# Altium schematic sheet CropPred.SchDoc
size 152 x 101 mm
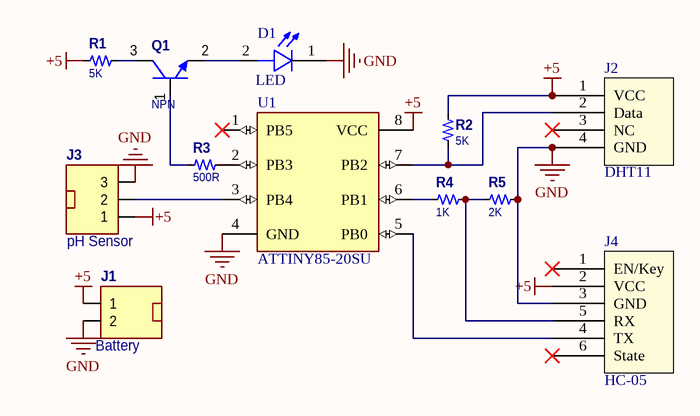
[diagram p0: CropPred.SchDoc]

## Parts
D1  LED  [LED_APA3010QBC/G-GX]
J1  Battery  [CON_HDR1x2_2p50_RA_SHRD_JST_S2B-HX-A]
J2  DHT11  [4posF]
J3  pH Sensor  [CON_HDR1x3_2p50_RA_SHRD_JST-S3B-XH-A]
J4  HC-05  [6posf]
Q1  NPN  [SOT323]
R1  5K  [0603-R_N]
R2  5K  [0603-R_N]
R3  500R  [0603-R_N]
R4  1K  [0603-R_N]
R5  2K  [0603-R_N]
U1  ATTINY85-20SU  [SOIC127P798X216-8N]

## Nets
+5: J1.1 J2.1(VCC) J3.1 J4.2(VCC) R1.2 R2.2 U1.8(VCC)
GND: D1.1(C) J1.2 J2.4(GND) J3.3 J4.3(GND) R5.1 U1.4(GND)
NetD1_2: D1.2(A) Q1.2(Emitter)
NetJ2_2: J2.2(Data) R2.1 U1.7(PB2)
NetJ3_2: J3.2 U1.3(PB4)
NetJ4_4: J4.4(TX) U1.5(PB0)
NetJ4_5: J4.5(RX) R4.1 R5.2
NetQ1_1: Q1.1(Base) R3.2
NetQ1_3: Q1.3(Collector) R1.1
NetR3_1: R3.1 U1.2(PB3)
NetR4_2: R4.2 U1.6(PB1)

Not connected (* = marked no-connect by the designer): J2 3(NC)*; J4 1(EN/Key)* 6(State)*; U1 1(PB5)*

## Library data of the parts
D1 = APA3010QBC/G-GX: Surface Mount LED; Size : 3.0X1.0mm ; Color: Blue; Lens: Water Clear; Package: None; Price: None; Value: *; MP: APA3010QBC/G-GX; Availability: Unavailable
J1 = CON_HDR1x2_2p50_RA_SHRD_JST_S2B-XH-A: Conn Shrouded Header HDR 2 POS 2.5mm Solder RA Thru-Hole Box; Manufacturer: JST; Manufacturer Part Number: S2B-XH-A(LF)(SN); Contact Resistance: 20mR; Max Current Rating: 3A; Number of Positions: 2; Max Voltage Rating (AC): 250V; Connector Type: Male Pin; Insulation Resistance: 1GR; Gender: Male; Wire/Cable Gauge: 22AWG; Supplier 1: Digi-Key; RoHS: Yes; Category: Headers and Wire Housings; Stock 1: 55640; Pricing 1: 1=0.17000, 10=0.16200, 100=0.11260, 500=0.09524, 1000=0.07792, 5000=0.06927, 10000=0.06277 (USD); Mount: Through Hole; Contact Plating: Tin,Copper,Lead; Contact Material: Brass; Color: Natural; Housing Color: White; Housing Material: Polyamide; Min Operating Temperature: -25°C; Max Operating Temperature: 85°C; Number of Rows: 1; Package Quantity: 1000; Packaging: Bulk; Termination: Press-Fit; Orientation: Right Angle; Current Rating: 3A; Voltage Rating (AC): 250V; Voltage Rating: 250V; Number of Contacts: 2; Max Voltage Rating (DC): 250V; Length: 7.4mm; Pitch: 2.5mm; Depth: 11.5mm; Lead Pitch: 2.5mm; Lead Free: Lead Free; REACH SVHC: No SVHC; ComponentLink1URL: http://www.jst-mfg.com/product/pdf/eng/eXH.pdf; ComponentLink1Description: Datasheet; Supplier Part Number 1: 455-2257-ND
J3 = CON_HDR1x3_2p50_RA_SHRD_JST_S3B-XH-A: Conn Shrouded Header (4 Sides) HDR 3 POS 2.5mm Solder RA Side Entry Thru-Hole Box; Manufacturer: JST; Manufacturer Part Number: S3B-XH-A(LF)(SN); Contact Resistance: 20mR; Current Rating: 3A; Voltage Rating (AC): 250V; Number of Positions: 3; Insulation Resistance: 1GR; Gender: Male; Connector Type: Male Pin; Wire/Cable Gauge: 22AWG; ComponentLink4Description: Datasheet; ComponentLink4URL: http://www.jst-mfg.com/product/pdf/eng/eXH.pdf; Supplier 1: Digi-Key; RoHS: Yes; Category: Headers and Wire Housings; Stock 1: 12903; Pricing 1: 1=0.22000, 10=0.20400, 100=0.14140, 500=0.11968, 1000=0.09792, 5000=0.08704, 10000=0.07888 (USD); Mount: Through Hole; Contact Plating: Tin,Lead,Copper; Contact Material: Brass; Color: Natural; Housing Color: White; Housing Material: Polyamide; Min Operating Temperature: -25°C; Max Operating Temperature: 85°C; Number of Rows: 1; Package Quantity: 1000; Packaging: Bulk; Max Current Rating: 3A; Voltage Rating: 250V; Termination: Press-Fit; Number of Contacts: 3; Max Voltage Rating (AC): 250V; Orientation: Right Angle; Length: 9.9mm; Lead Pitch: 2.5mm; Pitch: 2.5mm; Depth: 11.5mm; REACH SVHC: No SVHC; Lead Free: Lead Free; Supplier Part Number 1: 455-2250-ND
J4 = HC05
Q1 = Q_NPN 40V 0.2A SOT323: Bipolar (BJT) Transistor NPN 40V 200mA 300MHz 200mW Surface Mount SOT-323; Manufacturer: ON Semiconductor; Manufacturer Part Number: BC817-40LT3G; Max Power Dissipation: 300mW; Number of Elements: 1; hFE Min: 250; Collector Emitter Voltage (VCEO): 45V; Frequency: 100MHz; Collector Base Voltage (VCBO): 50V; Emitter Base Voltage (VEBO): 5V; Max Collector Current: 500mA; Element Configuration: Single; Collector Emitter Saturation Voltage: 700mV; Temperature Operating Max: 150°C; Temperature Operating Min: -55°C; Collector-emitter Voltage-Max: 300mV; Supplier 1: Digi-Key; Stock 1: 20000; Pricing 1: 10000=0.02394, 30000=0.02155, 50000=0.01915, 100000=0.01796, 250000=0.01596 (USD); Number of Pins: 3; Package Quantity: 1; Packaging: Tape and Reel; Collector Emitter Breakdown Voltage: 45V; Transition Frequency: 100MHz; Max Breakdown Voltage: 45V; Power Dissipation: 300mW; Max Frequency: 100MHz; Gain Bandwidth Product: 100MHz; Lead Free: Lead Free; Halogen Free: Halogen Free; REACH SVHC: No SVHC; ComponentLink1URL: http://www.onsemi.com/pub/Collateral/BC817-16LT1-D.PDF; ComponentLink1Description: Datasheet; Supplier Part Number 1: BC817-40LT3GOSTR-ND; Category: Transistors; Mounting Type: Surface Mount; Size Height: 0.94mm; Size Length: 2.90mm; Size Width: 1.30mm; Type: NPN; Supplier 2: Digi-Key; Stock 2: 1; Pricing 2: 1 = 0.28000, 10 = 0.19100, 25 = 0.19080, 100 = 0.09330, 500 = 0.07780, 1000 = 0.05406 (USD); Mount: Surface Mount; Min Operating Temperature: -55°C; Max Operating Temperature: 150°C; Polarity: NPN; Series: -; Radiation Hardening: No; RoHS Compliant: Yes; ComponentLink2URL: https://datasheet.ciiva.com/23661/1712528-23661528.pdf?src-supplier=Newark; ComponentLink2Description: https://datasheet.ciiva.com/23661/1712528-23661528.pdf?src-supplier=Newark; ComponentLink3URL: https://datasheet.ciiva.com/7643/1699592-7643036.pdf?src-supplier=Element14; ComponentLink3Description: https://datasheet.ciiva.com/7643/1699592-7643036.pdf?src-supplier=Element14; ComponentLink4URL: https://datasheet.ciiva.com/973/mmst3904sot-323-973107.pdf?src-supplier=Digi-Key; ComponentLink4Description: https://datasheet.ciiva.com/973/mmst3904sot-323-973107.pdf?src-supplier=Digi-Key; ComponentLink5URL: https://datasheet.ciiva.com/16290/mmst3904sot-323-20678-16290040.pdf?src-supplier=Mouser; ComponentLink5Description: https://datasheet.ciiva.com/16290/mmst3904sot-323-20678-16290040.pdf?src-supplier=Mouser; ComponentLink6URL: https://datasheet.ciiva.com/973/mmst3904sot-323-973108.pdf?src-supplier=Digi-Key; ComponentLink6Description: https://datasheet.ciiva.com/973/mmst3904sot-323-973108.pdf?src-supplier=Digi-Key; ComponentLink7URL: https://datasheet.ciiva.com/6362/mmst3904sot-323-6362170.pdf?src-supplier=Digi-Key; ComponentLink7Description: https://datasheet.ciiva.com/6362/mmst3904sot-323-6362170.pdf?src-supplier=Digi-Key; ComponentLink8URL: https://datasheet.ciiva.com/17380/mmst3904sot-323-17380250.pdf?src-supplier=Future+Electronics; ComponentLink8Description: https://datasheet.ciiva.com/17380/mmst3904sot-323-17380250.pdf?src-supplier=Future+Electronics; Case/Package: SOT23-3; Supplier Part Number 2: MMST3904TPMSCT-ND; Current Rating: 200mA; Voltage Rating (DC): 40V
R1-R5 = R_0R_1/10W_1%_0603: YAGEO - RC0603FR-070RL - RES, THICK FILM, 0R, 1%, 0.1W, 0603; Resistance: 0mR; Power Rating: 100mW; Voltage Rating: 50V; Temperature Coefficient: 200ppm/°C; Current Rating: 1A; Working Voltage: 75V; ComponentLink1URL: https://datasheet.ciiva.com/11809/0900766b80fcdb72-11809199.pdf?src-supplier=RSComponents; ComponentLink1Description: Datasheet; Supplier 1: Digi-Key; Manufacturer: Yageo; Manufacturer Part Number: RC0603FR-070RL; RoHS: Yes; Category: Chip SMD Resistors; Stock 1: 1237372; Pricing 1: 1=0.10000, 10=0.01800, 25=0.01320, 50=0.01000, 100=0.00730, 250=0.00560, 500=0.00446, 1000=0.00329 (USD); Number of Pins: 2; Case Code (Metric): 1608; Case Code (Imperial): 0603; Contact Plating: Tin,Matte; Min Operating Temperature: -55°C; Max Operating Temperature: 155°C; Packaging: Tape and Reel; Package Quantity: 5000; Resistor Type: Thick Film; Number of Terminations: 2; Termination: SMD/SMT; Max Power Dissipation: 100mW; Voltage Rating (DC): 50V; Features: Moisture Resistant; Length: 1.6mm; Width: 0.031inch; Height: 0.45mm; Depth: 0.8mm; Radiation Hardening: No; REACH SVHC: No SVHC; Military Standard: Not; Lead Free: Lead Free; Supplier Part Number 1: 311-0.0HRCT-ND; Tolerance: 1%; Case/Package: 0603
U1 = ATTINY85-20SU: AVR AVRÂ® ATtiny, IC de microcontrolador de seguridad funcional (FuSa) de 8 bits, 20 MHz, 8 KB (4K x 16), FLASH 8-SOIC; MF: Microchip; MP: ATTINY85-20SU; Package: SOIC-8 Microchip; SnapEDA_Link: https://www.snapeda.com/parts/ATTINY85-20SU/Microchip/view-part/681099/?ref=snap; Check_prices: https://www.snapeda.com/parts/ATTINY85-20SU/Microchip/view-part/681099/?ref=eda; Availability: In Stock; Value: *; Price: None